# EAGLE design tvac_systems_interface (EAGLE 9.5.0)
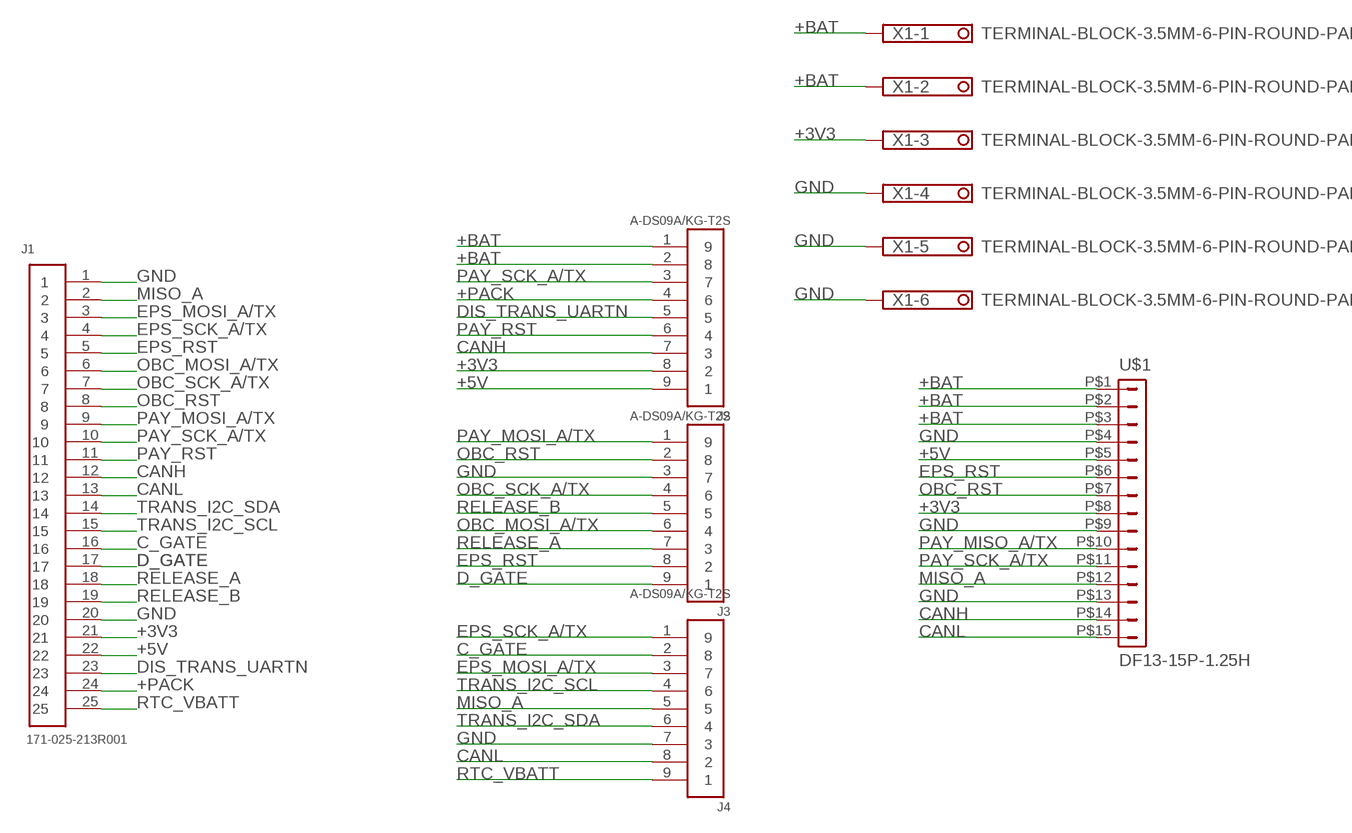
[diagram p0: schematic, sheet 1]

## Parts
J1  171-025-213R001  [171-025-213R001]
J2  A-DS09A/KG-T2S  [A-DS09A/KG-T2S]
J3  A-DS09A/KG-T2S  [A-DS09A/KG-T2S]
J4  A-DS09A/KG-T2S  [A-DS09A/KG-T2S]
U$1  DF13-15P-1.25H  [DF13A-15P-1.25H]
X1  TERMINAL-BLOCK-3.5MM-6-PIN-ROUND-PAD  [TERMINAL-BLOCK-6-PIN-3.5MM-ROUND-PAD]

## Nets
+3V3 [power]: J1.21 J2.8 U$1.P$8 X1.3
+5V [power]: J1.22 J2.9 U$1.P$5
+BAT [power]: J2.1 J2.2 U$1.P$1 U$1.P$2 U$1.P$3 X1.1 X1.2
+PACK: J1.24 J2.4
C_GATE: J1.16 J4.2
CANH: J1.12 J2.7 U$1.P$14
CANL: J1.13 J4.8 U$1.P$15
D_GATE: J1.17 J3.9
DIS_TRANS_UARTN: J1.23 J2.5
EPS_MOSI_A/TX: J1.3 J4.3
EPS_RST: J1.5 J3.8 U$1.P$6
EPS_SCK_A/TX: J1.4 J4.1
GND [power]: J1.1 J1.20 J3.3 J4.7 U$1.P$4 U$1.P$9 U$1.P$13 X1.4 X1.5 X1.6
MISO_A: J1.2 J4.5 U$1.P$12
OBC_MOSI_A/TX: J1.6 J3.6
OBC_RST: J1.8 J3.2 U$1.P$7
OBC_SCK_A/TX: J1.7 J3.4
PAY_MISO_A/TX: U$1.P$10
PAY_MOSI_A/TX: J1.9 J3.1
PAY_RST: J1.11 J2.6
PAY_SCK_A/TX: J1.10 J2.3 U$1.P$11
RELEASE_A: J1.18 J3.7
RELEASE_B: J1.19 J3.5
RTC_VBATT: J1.25 J4.9
TRANS_I2C_SCL: J1.15 J4.4
TRANS_I2C_SDA: J1.14 J4.6

## Library data of the parts
J1 = D-Sub Connectors:171-025-213R001: CONN D-SUB RCPT 25P PNL MNT SLDR Manufacturer's datasheet <https://www.norcomp.net/rohspdfs/Connectors/17Y/171/171-YYY-213RYY1.pdf>; CREATED_BY: PCBLayout.com; DIGIKEY_PART_NO: 4225FE-ND; MANUFACTURER: NorComp Inc.; MPN: 171-025-213R001
J2-J4 = D-Sub Connectors:A-DS09A/KG-T2S: CONN D-SUB PLUG 9POS R/A SOLDER Manufacturer's datasheet <http://www.assmann-wsw.com/fileadmin/datasheets/ASS_4888_CO.pdf>; CREATEDBY: PCBLayout.com; DIGI_KEY_PART_NUMBER: AE10968-ND; MANUFACTURER: Assmann WSW Components; MPN: A-DS 09 A/KG-T2S
U$1 = con-hirose-df13:DF13-15P-1.25: DF13-15P 1.25mm Pitch Miniature Crimping Connector.
X1 = Rembrandt Electronics - Terminal Block 3-5mm v1-0:TERMINAL-BLOCK-3.5MM-6-PIN: Terminal Block 3.5mm Pitch: 3,5 mm Number of pins: 6 Created by Rembrandt Electronics www.rembrandtelectronics.com

## Net classes
1 power: width 1.016 mm

## Board
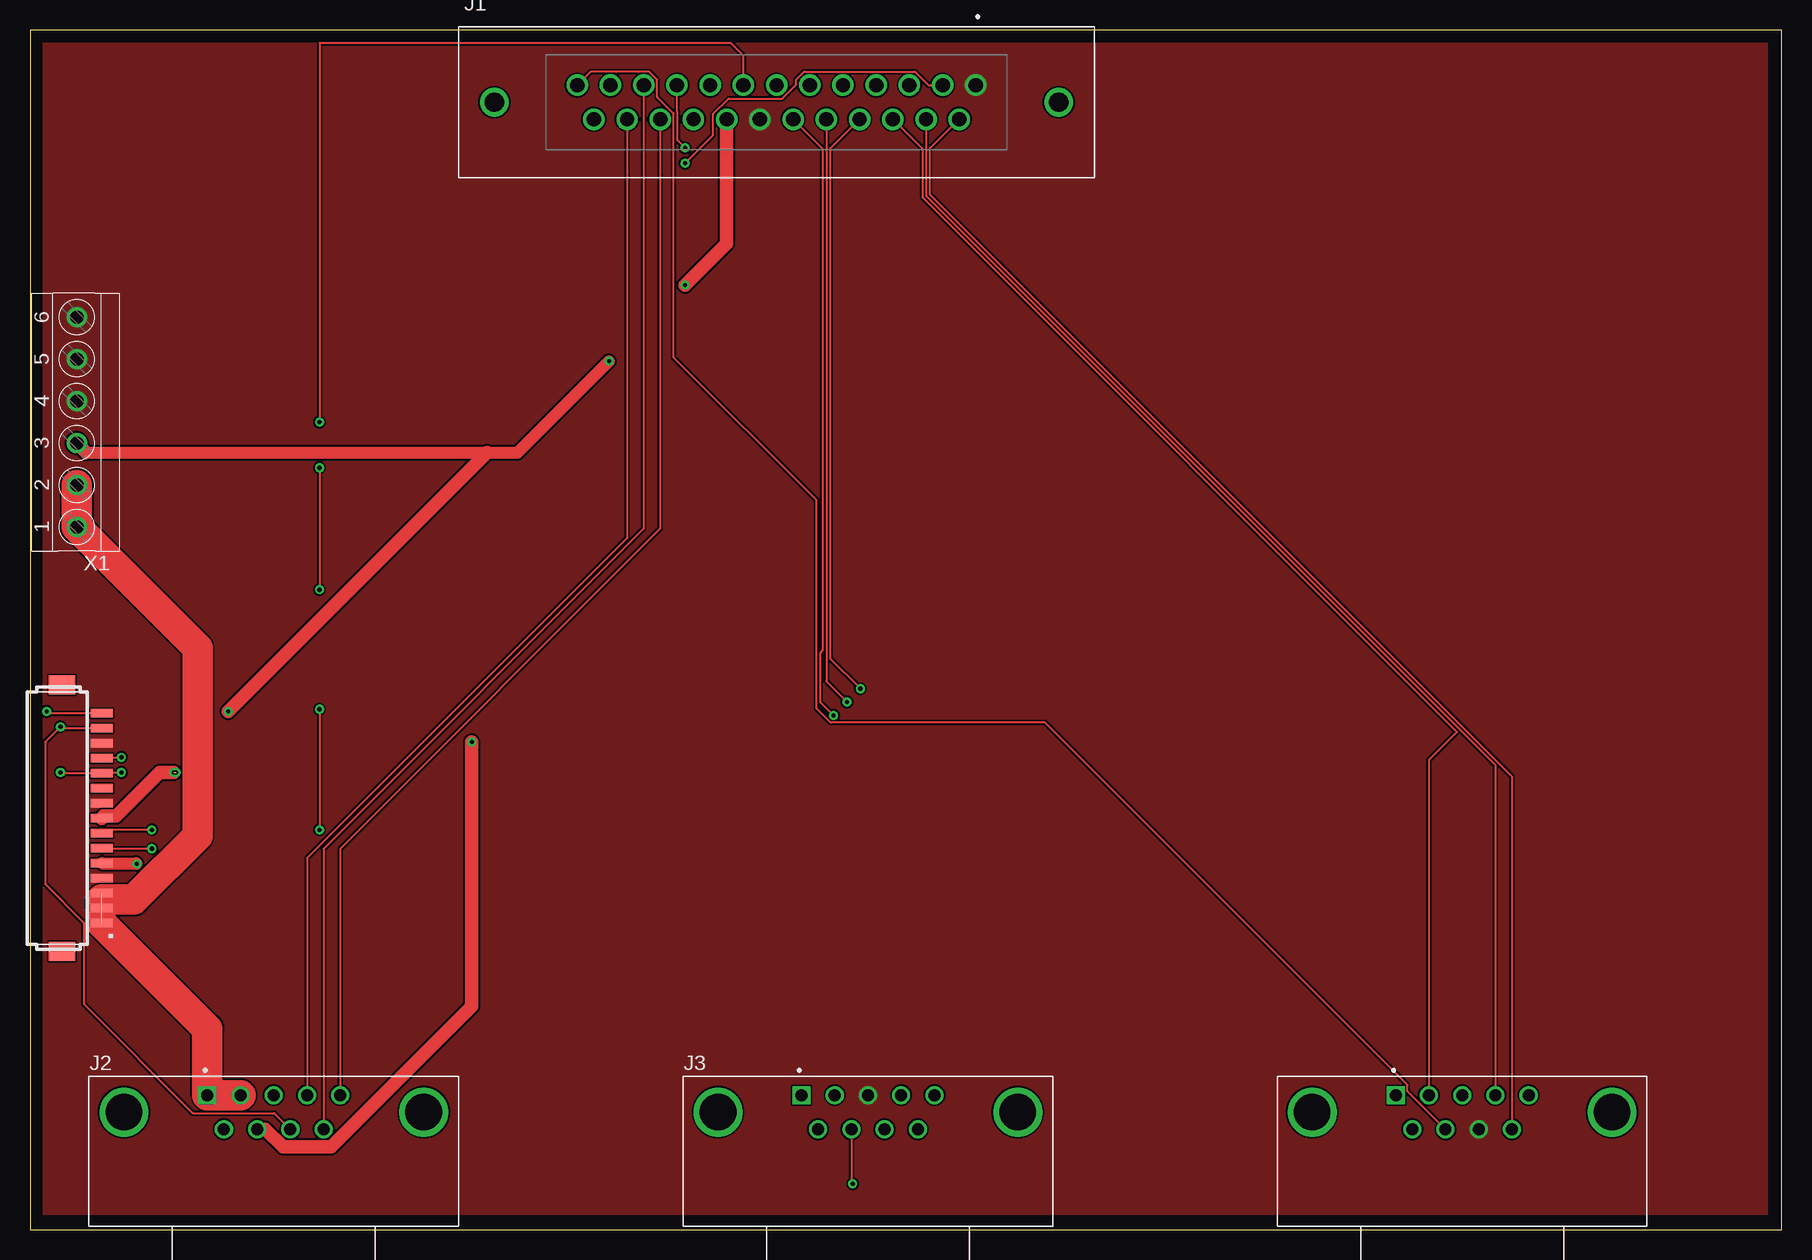
[diagram p1: board, top side]
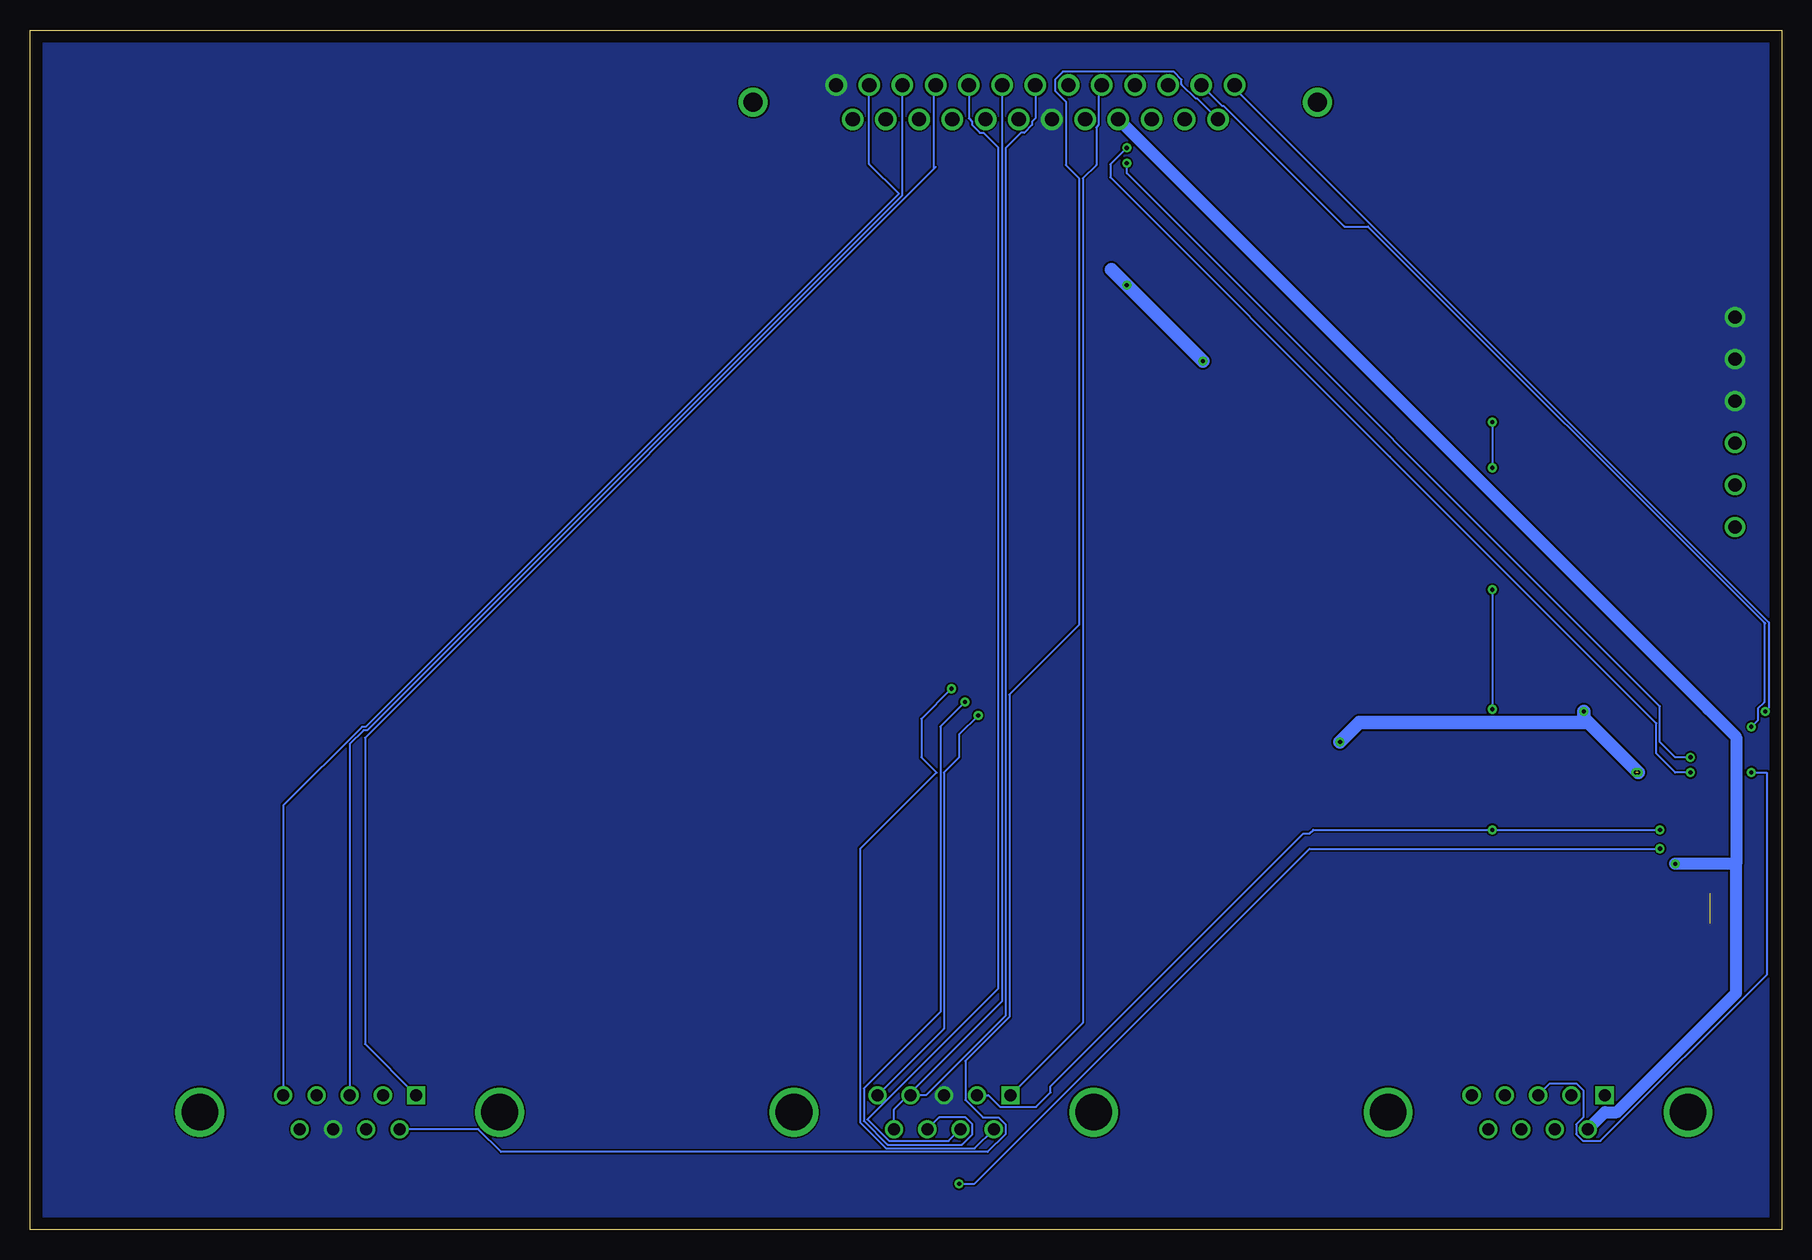
[diagram p2: board, bottom side, seen from below]

Size 146.03 x 100 mm. Coordinates in mm from the lower left corner, seen from the top.
Outline: 0,0 146.03,0 146.03,100 0,100 0,0
Copper layers (1*16): Top 0.035mm / dielectric 1.5mm / Bottom 0.035mm
Design rules "default": minimum track width 6mil, minimum drill 0.35mm, track to track 6mil, track to pad 6mil, pad to pad 6mil, via to via 6mil, smd to smd 6mil, copper to edge 40mil, drill to drill 6mil, minimum pad ring 10mil, minimum via ring 8mil, stop-mask expansion 4mil, vias tented up to drill 0mil, thermal gap 10mil

### Footprints (pad centres in the part's own frame; a part is rotated, then mirrored left to right if it is on the bottom)
171-025-213R001 = drill 1.194: 1 16.612,1.422; 2 13.843,1.422; 3 11.074,1.422; 4 8.306,1.422; 5 5.537,1.422; 6 2.769,1.422; 7 0,1.422; 8 -2.769,1.422; 9 -5.537,1.422; 10 -8.306,1.422; 11 -11.074,1.422; 12 -13.843,1.422; 13 -16.612,1.422; 14 15.227,-1.422; 15 12.459,-1.422; 16 9.69,-1.422; 17 6.921,-1.422; 18 4.153,-1.422; 19 1.384,-1.422; 20 -1.384,-1.422; 21 -4.153,-1.422; 22 -6.921,-1.422; 23 -9.69,-1.422; 24 -12.459,-1.422; 25 -15.227,-1.422 | drill 1.6: P$1 -23.52,0; P$2 23.52,0
A-DS09A/KG-T2S = drill 1 square: 1 -5.54,1.42 | drill 1: 2 -2.77,1.42; 3 0,1.42; 4 2.77,1.42; 5 5.54,1.42; 6 4.155,-1.42; 7 1.385,-1.42; 8 -1.385,-1.42; 9 -4.155,-1.42 | drill 3.05: P$1 -12.495,0; P$2 12.495,0
DF13A-15P-1.25H = smd 1.6 x 2.2: M$0 -11.1,2.4; M$1 11.1,2.4 | smd 0.7 x 1.8: P$1 -8.75,-0.9; P$2 -7.5,-0.9; P$3 -6.25,-0.9; P$4 -5,-0.9; P$5 -3.75,-0.9; P$6 -2.5,-0.9; P$7 -1.25,-0.9; P$8 0,-0.9; P$9 1.25,-0.9; P$10 2.5,-0.9; P$11 3.75,-0.9; P$12 5,-0.9; P$13 6.25,-0.9; P$14 7.5,-0.9; P$15 8.75,-0.9
TERMINAL-BLOCK-6-PIN-3.5MM-ROUND-PAD = drill 1.1 pad 1.7: 1 -8.75,-0.1; 2 -5.25,-0.1; 3 -1.75,-0.1; 4 1.75,-0.1; 5 5.25,-0.1; 6 8.75,-0.1

### Placement (x,y rotation side)
J1  62.23,93.98 0 top
J2  20.32,9.78 0 top
J3  69.85,9.78 0 top
J4  119.38,9.78 0 top
U$1  5.08,34.29 90 top
X1  3.81,67.31 90 top

### Tracks (layer width: path | path; a pad name or v marks a point on that pad's centre or on a via)
+3V3  (via drill 0.35)  (1 unrouted)
  Top 1.016: v48.26,72.39 40.64,64.77 38.1,64.77 4.7,64.77
  Top 1.143: J1.21 58.08,82.21 v54.61,78.74 | X1.3 4.7,64.77 | U$1.P$8 6.16,34.47 7.18,34.47 10.81,38.1 v11.98,38.1 | v16.51,43.18 38.1,64.77 | v36.83,40.64 36.83,18.62 25.09,6.88 21.09,6.88 19.61,8.36 J2.8
  Bottom 1.143: 55.88,80.01 v54.61,78.74 v48.26,72.39 | v11.98,38.1 16.15,42.27 | 16.15,42.27 16.51,42.63 v16.51,43.18 | v36.83,40.64 35.2,42.27 16.15,42.27
  other vias: 12.17,38.1
+5V  (via drill 0.35)
  Top 1.016: U$1.P$5 8.83,30.54 v8.89,30.48
  Bottom 1.016: J1.22 6.14,43.39 3.81,41.06 3.81,30.48 | J2.9 14.74,9.79 13.75,9.79 3.81,19.73 3.81,30.48 | 3.81,30.48 v8.89,30.48
+BAT  (2 unrouted)
  Top 2.54: X1.2 X1.1 13.97,48.5 13.97,32.83 8.66,27.52 5.98,27.52 U$1.P$2 | J2.2 J2.1 14.78,16.74 U$1.P$1
+PACK
  Top 0.152: J1.24 49.77,57.64 23.09,30.96 J2.4
C_GATE
  Top 0.152: J4.2 116.61,39.14 118.95,41.48 74.38,86.04 74.38,90.09 J1.16
CANH  (via drill 0.35)
  Top 0.152: U$1.P$14 2.66,41.79 v2.54,41.91 1.27,40.64 1.27,28.79 4.48,25.58 4.48,18.8 13.58,9.7 20.36,9.7 J2.7
  Bottom 0.152: J1.12 46.67,93.68 46.54,93.68 36.46,83.6 34.51,83.6 1.49,50.58 | 1.49,50.58 1.4,50.5 | 1.49,50.58 1.49,43.95 2,43.43 2,42.45 v2.54,41.91
CANL  (via drill 0.35)
  Top 0.152: J4.8 114.82,11.53 114.82,12.05 84.62,42.25 66.74,42.25 65.56,43.43 65.56,60.8 53.66,72.69 53.66,93.02 52.28,94.41 52.28,95.87 51.62,96.53 50.69,96.53 50.68,96.52 48.86,96.52 48.85,96.53 46.74,96.53 J1.13 | U$1.P$15 1.41,43.04 1.27,43.18 v1.39,43.18
  Bottom 0.152: J1.13 45.62,95.15 1.09,50.62 1.09,43.48 v1.39,43.18
D_GATE  (via drill 0.35)
  Top 0.152: v69.22,45.09 66.69,47.61 66.69,90.09 J1.17
  Bottom 0.152: J3.9 67.29,6.77 74.67,6.77 76.83,8.93 76.83,31.73 70.46,38.1 71.73,39.37 71.73,42.57 v69.22,45.09
DIS_TRANS_UARTN
  Top 0.152: J1.23 52.54,58.42 25.86,31.74 J2.5
EPS_MOSI_A/TX
  Bottom 0.152: J4.3 119.38,40.46 118.24,41.6 117.93,41.6 73.42,86.12 73.3,86.23 J1.3
EPS_RST  (via drill 0.35)
  Top 0.152: J3.8 68.47,3.92 v68.58,3.81 | U$1.P$6 6.02,31.75 v10.16,31.75
  Bottom 0.152: J1.5 67.77,92.63 67.51,92.37 67.51,92.09 66.85,91.43 66.57,91.43 65.3,90.17 65.3,20.11 76.22,9.19 74.41,7.38 69.45,7.38 J3.8 | v68.58,3.81 67.31,3.81 39.37,31.75 v10.16,31.75
EPS_SCK_A/TX
  Bottom 0.152: J4.1 118.11,15.47 118.11,41 70.66,88.44 | 70.54,88.57 70.66,88.44 | 70.66,88.44 70.66,95.28 J1.4
GND
  pour Top (no thermals): 0,99.06 144.78,99.06 144.78,1.27 143.51,1.27 0,1.27 0,3.81
  pour Bottom (no thermals): 1.27,100.33 146.05,100.33 146.05,0 144.78,0 0,0 0,1.27 0,100.33
MISO_A  (via drill 0.35)
  Top 0.152: U$1.P$12 6.06,39.37 v7.62,39.37 | J1.2 74.89,95.4 73.77,96.53 64.53,96.53 63.88,95.87 63.88,95.46 62.7,94.28 58.21,94.28 56.95,93.02 56.95,91.24 v54.61,88.9
  Bottom 0.152: J4.5 124.92,35.35 118.36,41.91 118.06,41.91 73.61,86.36 76.07,88.82 J1.2 | v7.62,39.37 8.89,39.37 10.16,40.64 10.16,43.61 54.61,88.06 v54.61,88.9
OBC_MOSI_A/TX
  Bottom 0.152: J3.6 74,10.02 65,19.02 J1.6
OBC_RST  (via drill 0.35)
  Top 0.152: U$1.P$7 6.26,33.33 v10.16,33.33 | J1.8 59.46,97.87 58.42,98.91 24.13,98.91 v24.13,67.31 | v24.13,63.5 v24.13,53.34 | v24.13,43.37 v24.13,33.33
  Bottom 0.152: J3.2 66.14,11.2 65.16,10.22 62.17,10.22 60.96,11.43 60.96,11.96 39.9,33.02 39.37,33.02 39.06,33.33 v24.13,33.33 v10.16,33.33 | v24.13,67.31 v24.13,63.5 | v24.13,53.34 v24.13,43.37 24.13,43.18
OBC_SCK_A/TX
  Bottom 0.152: J1.7 62.23,92.63 62.49,92.37 62.49,92.09 63.15,91.43 63.43,91.43 64.69,90.17 64.69,17.86 71.35,11.2 J3.4
PAY_MOSI_A/TX
  Bottom 0.152: J1.9 56.95,95.14 56.95,92.09 57.15,91.89 57.15,88.75 58.27,87.63 58.27,17.24 J3.1
PAY_RST
  Top 0.152: J1.11 51.16,58.42 24.48,31.74 J2.6
PAY_SCK_A/TX  (via drill 0.35)
  Top 0.152: v7.62,38.1 6.04,38.1 U$1.P$11 2.6,38.04 v2.54,38.1 | v54.61,90.17 53.97,90.81 53.97,93.15 53.92,93.19 J1.10
  Bottom 0.152: v7.62,38.1 8.89,38.1 10.46,39.67 10.46,42.2 32.66,64.39 32.66,64.41 55.97,87.72 55.97,88.81 v54.61,90.17 | J2.3 19.34,12.18 17.14,12.18 16.57,11.61 16.57,9.35 17.15,8.77 17.15,7.95 16.57,7.38 15.12,7.38 1.27,21.23 1.27,38.1 v2.54,38.1
RELEASE_A  (via drill 0.35)
  Top 0.152: v68.1,43.97 66.38,45.69 J1.18
  Bottom 0.152: J3.7 70.25,9.34 68.06,9.34 67.48,8.77 67.48,7.95 68.36,7.07 74.54,7.07 76.53,9.06 76.53,11.77 70.16,18.14 70.16,41.92 v68.1,43.97
RELEASE_B  (via drill 0.35)
  Top 0.152: v66.99,42.86 65.86,43.98 65.86,48.08 66.08,48.3 66.08,90.09 J1.19
  Bottom 0.152: J3.5 69.85,16.74 69.85,38.1 68.58,39.37 68.58,41.27 v66.99,42.86
RTC_VBATT
  Bottom 0.152: J1.25 48.72,94.28 48.85,94.28 50.03,95.46 50.03,95.87 50.69,96.53 59.93,96.53 60.59,95.87 60.59,94.94 59.69,94.04 59.69,88.75 58.57,87.63 58.57,50.41 64.39,44.6 64.39,17.73 68.06,14.05 68.06,10.79 66.61,9.34 65.29,9.34 64.71,8.77 64.71,7.95 66.2,6.46 106.77,6.46 108.66,8.36 J4.9
TRANS_I2C_SCL
  Top 0.152: J4.4 122.15,38.71 74.69,86.17 J1.15
TRANS_I2C_SDA
  Top 0.152: J4.6 123.53,37.76 74.99,86.3 74.99,90.09 J1.14